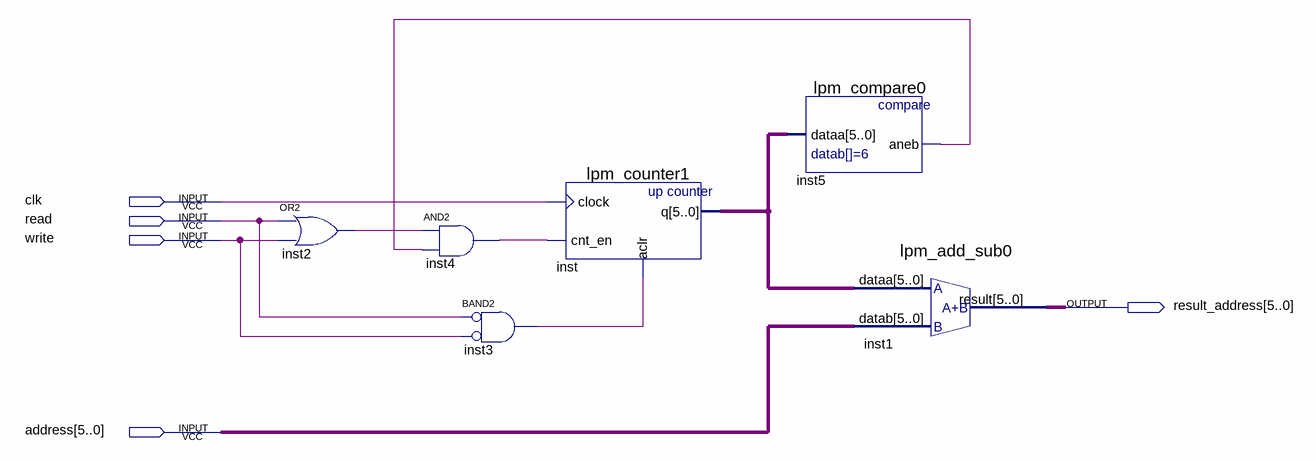
[diagram p0: schematic sheet]
// Quartus schematic ADDRESS_CONTROLLER.bdf as structural Verilog: 6 symbols, 5 pins
module ADDRESS_CONTROLLER (
  input  clk,
  input  read,
  input  write,
  input  [5:0] address,
  output [5:0] result_address
);

  wire inst2_out, inst3_out, inst4_out, inst5_aneb;
  wire [5:0] inst_q;

  or inst2 (inst2_out, read, write);
  and inst4 (inst4_out, inst2_out, inst5_aneb);
  and inst3 (inst3_out, ~read, ~write);  // BAND2
  lpm_counter1 inst (.clock(clk), .cnt_en(inst4_out), .aclr(inst3_out), .q(inst_q));
  lpm_compare0 inst5 (.dataa(inst_q), .aneb(inst5_aneb));
  lpm_add_sub0 inst1 (.dataa(inst_q), .datab(address), .result(result_address));
endmodule
